# EAGLE design temphumid-gpour-usb (EAGLE 9.1.3)
CREVISION: v1.0; DESIGNER: John Cronin
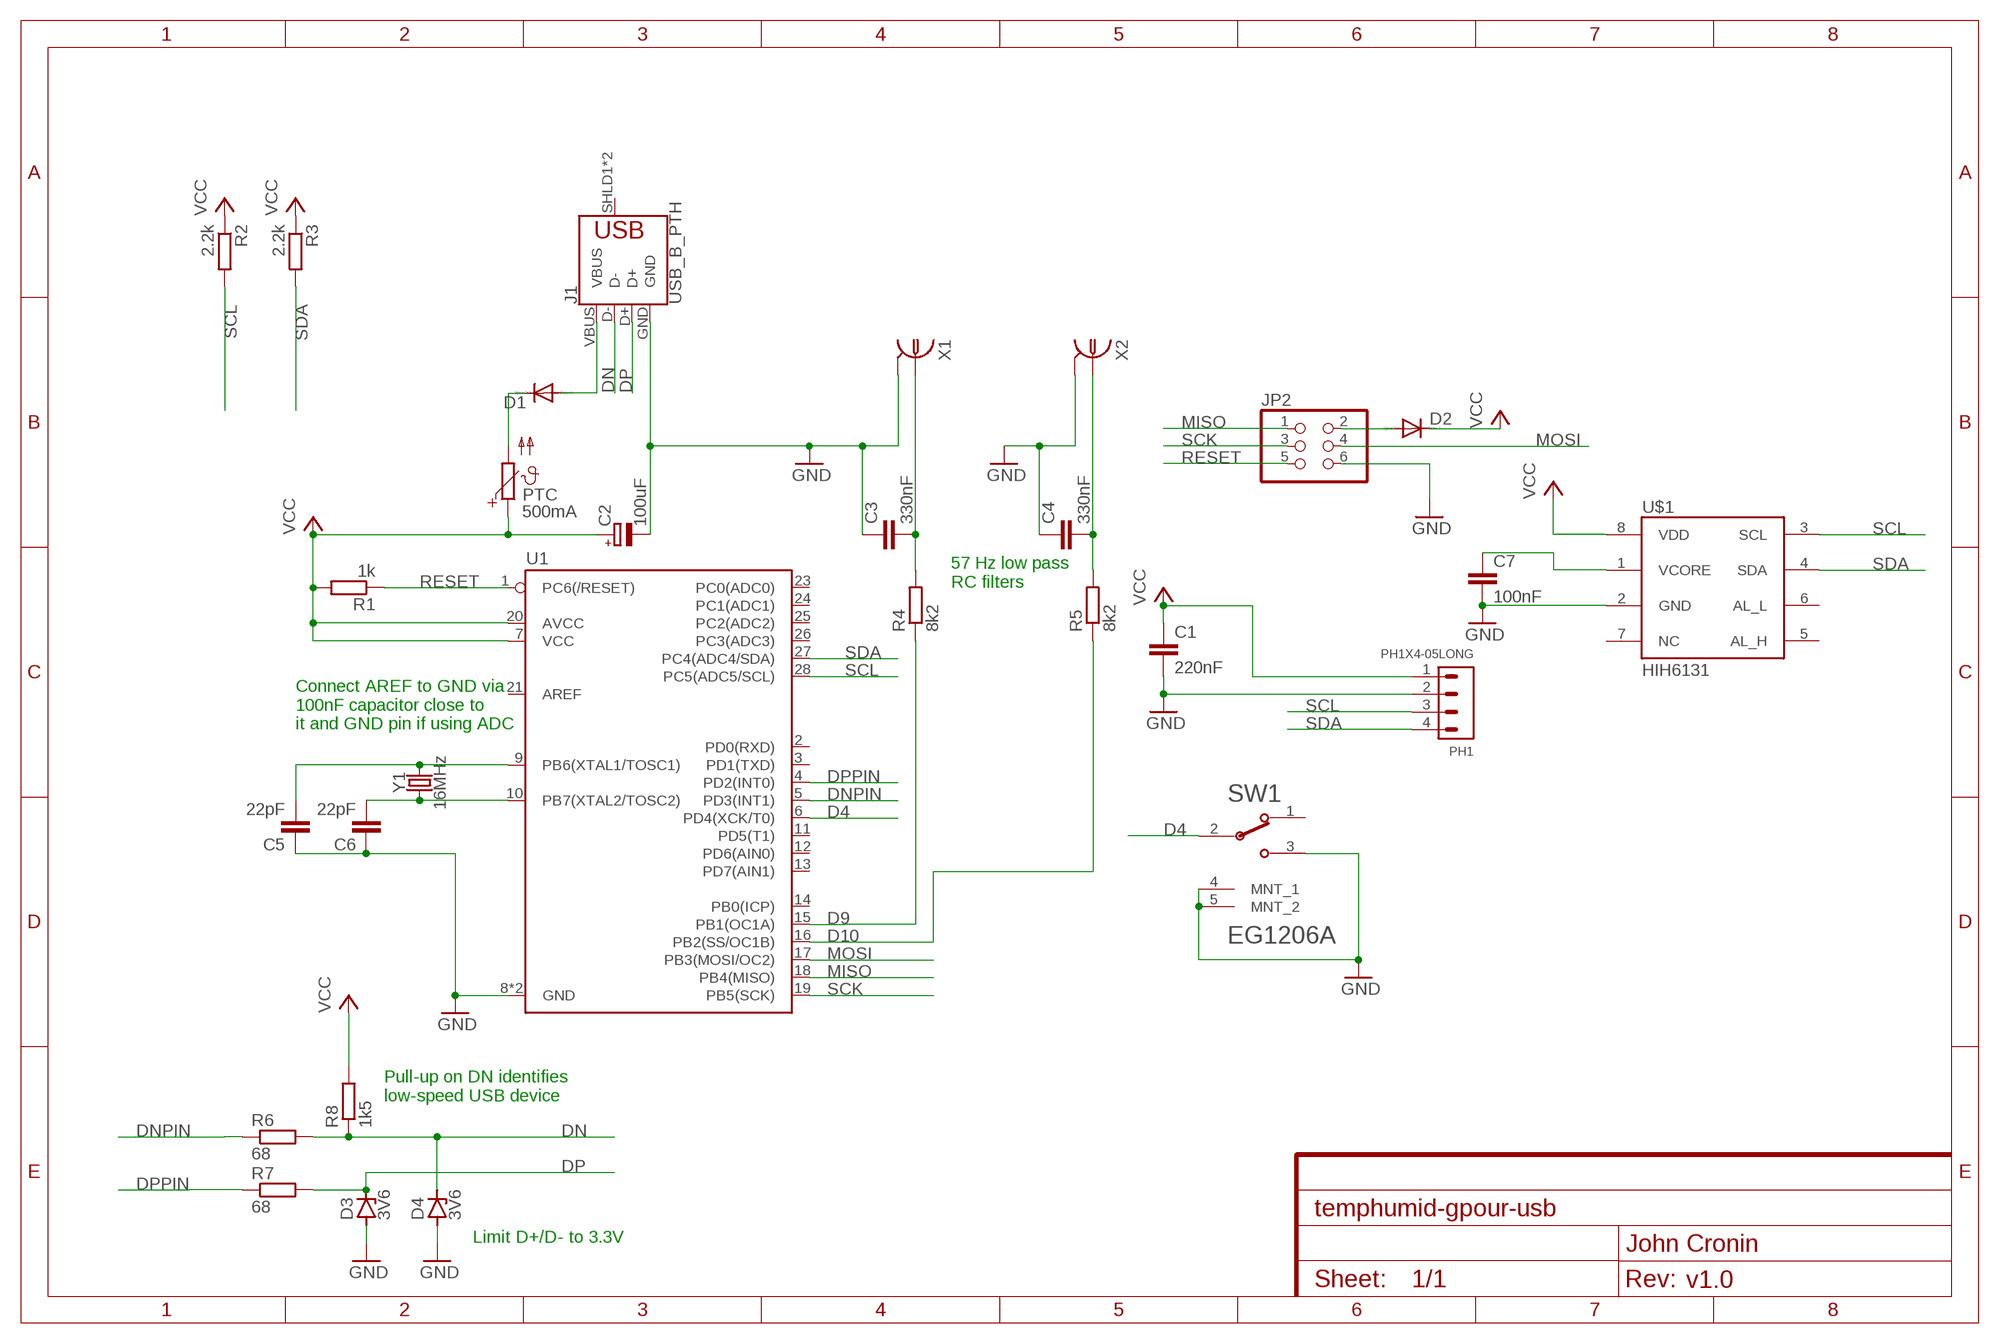
[diagram p0: schematic, sheet 1]

## Parts
C1  220nF  C-EU025-024X044  [C025-024X044]
C2  100uF  CPOL-EUE2,5-6E  [E2,5-6E]
C3  330nF  C-EU025-024X044  [C025-024X044]
C4  330nF  C-EU025-024X044  [C025-024X044]
C5  22pF  C-EU025-024X044  [C025-024X044]
C6  22pF  C-EU025-024X044  [C025-024X044]
C7  100nF  C-EU025-024X044  [C025-024X044]
D1  1N4004  [DO41-10]
D2  1N4004  [DO41-10]
D3  3V6  ZENER-DIODEDO35Z10  [DO35Z10]
D4  3V6  ZENER-DIODEDO35Z10  [DO35Z10]
J1  USB_B_PTH  [USB-B-PTH]
JP2  PINHD-2X3  [2X03]
PH1  PH1X4-05LONG  [PHL005-1-4]
PTC  500mA  PTC679  [P679]
R1  1k  R-EU_0207/7  [0207/7]
R2  2.2k  R-EU_0207/7  [0207/7]
R3  2.2k  R-EU_0207/7  [0207/7]
R4  8k2  R-EU_0207/12  [0207/12]
R5  8k2  R-EU_0207/12  [0207/12]
R6  68  R-EU_0204/7  [0204/7]
R7  68  R-EU_0204/7  [0204/7]
R8  1k5  R-EU_0204/7  [0204/7]
SW1  E-SWITCH_EG1206AE-SWITCH_EG1206A_0_0  [E-SWITCH_EG1206A_0]
U1  ATMEGA328P_PDIP  [DIP28]
U$1  HIH6131  [SOIC8]
X1  227161-8  [AMP_227161]
X2  227161-8  [AMP_227161]
Y1  16MHz  CRYSTALPTH-HC49US  [HC49US]

## Nets
D4: SW1.2(COM) U1.6(PD4(XCK/T0))
D9: R4.1 U1.15(PB1(OC1A))
D9OUT: C3.2 R4.2 X1.1
D10: R5.1 U1.16(PB2(SS/OC1B))
D10OUT: C4.2 R5.2 X2.1
DN: D4.C J1.D- R6.2 R8.1
DNPIN: R6.1 U1.5(PD3(INT1))
DP: D3.C J1.D+ R7.2
DPPIN: R7.1 U1.4(PD2(INT0))
GND: C1.2 C2.- C3.1 C4.1 C5.1 C6.1 C7.2 D3.A D4.A J1.GND JP2.6 PH1.2 SW1.3 SW1.4(MNT_1) SW1.5(MNT_2) U1.8(GND) U1.22(GND) U$1.2(GND) X1.2 X2.2
MISO: JP2.1 U1.18(PB4(MISO))
MOSI: JP2.4 U1.17(PB3(MOSI/OC2))
N$1: D1.C PTC.2
N$2: D1.A J1.VBUS
N$3: D2.A JP2.2
N$5: C5.2 U1.9(PB6(XTAL1/TOSC1)) Y1.2
N$6: C6.2 U1.10(PB7(XTAL2/TOSC2)) Y1.1
N$9: C7.1 U$1.1(VCORE)
RESET: JP2.5 R1.1 U1.1(PC6(/RESET))
SCK: JP2.3 U1.19(PB5(SCK))
SCL: PH1.3 R2.2 U1.28(PC5(ADC5/SCL)) U$1.3(SCL)
SDA: PH1.4 R3.2 U1.27(PC4(ADC4/SDA)) U$1.4(SDA)
VCC: C1.1 C2.+ D2.C PH1.1 PTC.1 R1.2 R2.1 R3.1 R8.2 U1.7(VCC) U1.20(AVCC) U$1.8(VDD)
Unconnected: J1.SHLD1(SHIELD) J1.SHLD2(SHIELD) SW1.1 U1.2(PD0(RXD)) U1.3(PD1(TXD)) U1.11(PD5(T1)) U1.12(PD6(AIN0)) U1.13(PD7(AIN1)) U1.14(PB0(ICP)) U1.21(AREF) U1.23(PC0(ADC0)) U1.24(PC1(ADC1)) U1.25(PC2(ADC2)) U1.26(PC3(ADC3)) U$1.5(AL_H) U$1.6(AL_L) U$1.7(NC)

## Notes on the sheet
- 57 Hz low pass
  RC filters
- Connect AREF to GND via
  100nF capacitor close to
  it and GND pin if using ADC
- Pull-up on DN identifies
  low-speed USB device
- Limit D+/D- to 3.3V

## Library data of the parts
C1 C3-C7 = resistor:C-EU: CAPACITOR, European symbol
C2 = resistor:CPOL-EU: POLARIZED CAPACITOR, European symbol
D1 D2 = diode:1N4004: DIODE general purpose rectifier, 1 A
D3 D4 = diode:ZENER-DIODE: Z-Diode
J1 = SparkFun-Connectors:USB_B: USB Type B Connector SparkFun Products: SparkFun Stepoko <https://www.sparkfun.com/products/13899> PTH; PROD_ID: CONN-08278; SF_ID: PRT-00139
JP2 = pinhead:PINHD-2X3: PIN HEADER
PH1 = pel_hdr:PH1X4
PTC = ptc-ntc:PTC679: PHILIPS PTC; OC_FARNELL: unknown; OC_NEWARK: unknown
R1-R8 = resistor:R-EU_: RESISTOR, European symbol
SW1 = E-Switch - EG1206A:E-SWITCH_EG1206A: Slide Switch SPDT 200mA 30V; CENTROID_NOT_SPECIFIED: No; DATASHEET: http://spec_sheets.e-switch.com/specs/P040021.pdf; DIGIKEY_DESCRIPTION: SWITCH Slide Switch SPDT Through Hole, Right Angle; DIGIKEY_PART_NUMBER: EG1917-ND; LEAD_FREE: yes; MF: E-Switch; MOUSER_PART_NUMBER: 612-EG1206A; MPN: EG1206A; PACKAGE: SIP; PREFIX: SW; ROHS: yes; TEMPERATURE_RANGE_HIGH: +70°C; TEMPERATURE_RANGE_LOW: -20°C
U1 = SparkFun-IC-Microcontroller:ATMEGA328P_PDIP: Atmel 328P Through hole ATMEGA328P uC used in the Arduino 32kb flash, 1k EEPROM, 2k SRAM Datasheet <http://www.sparkfun.com/datasheets/Components/SMD/ATMega328.pdf> SparkFun Products Storefront component: AVR 28 Pin 20MHz 32K 6A/D - ATMega328P <https://www.sparkfun.com/products/9061> (COM-09061) SparkFun Simon Says - Through-Hole Soldering Kit <https://www.sparkfun.com/products/10547> (KIT-10547) SparkFun Learn to Solder - Simon Says <https://www.sparkfun.com/products/13708> (KIT-13708) SparkFun BigTime Watch Kit <https://www.sparkfun.com/products/11734> (KIT-11734) SparkFun ClockIt <https://www.sparkfun.com/products/10930> (KIT-10930) SparkFun Serial Enabled LCD Kit <https://www.sparkfun.com/products/10097> (LCD-10097) SparkFun Simon Tilts - Through Hole Soldering Kit <https://www.sparkfun.com/products/12634> (KIT-12634) SparkFun Frequency Counter Kit <https://www.sparkfun.com/products/10140> (KIT-10140) FabFM Radio Kit <https://www.sparkfun.com/products/11043> (KIT-11043) SparkFun Binary Blaster Kit <https://www.sparkfun.com/products/12037> (KIT-12037) SparkFun Metro-Gnome <https://www.sparkfun.com/products/9236> (KIT-09236) ATmega328 with Arduino Optiboot (Uno) <https://www.sparkfun.com/products/10524> (DEV-10524); PROD_ID: IC-09136; VALUE: 328P
U$1 = SparkFun-Retired:HIH6131: Humidity sensor Not in catalog
X1 X2 = con-coax:?227161*: JACK, RIGHT ANGLE, 50 OHM, PCB, BNC Source: amp_227161.pdf; OC_FARNELL: unknown; OC_NEWARK: unknown
Y1 = SparkFun-Clocks:CRYSTAL: Crystals (Generic) These are passive quartz crystals, which can be used as a clock source for a microcontroller. Crystal's are two-terminal devices. They require external "load" capacitors to generate an oscillating signal.

## Board
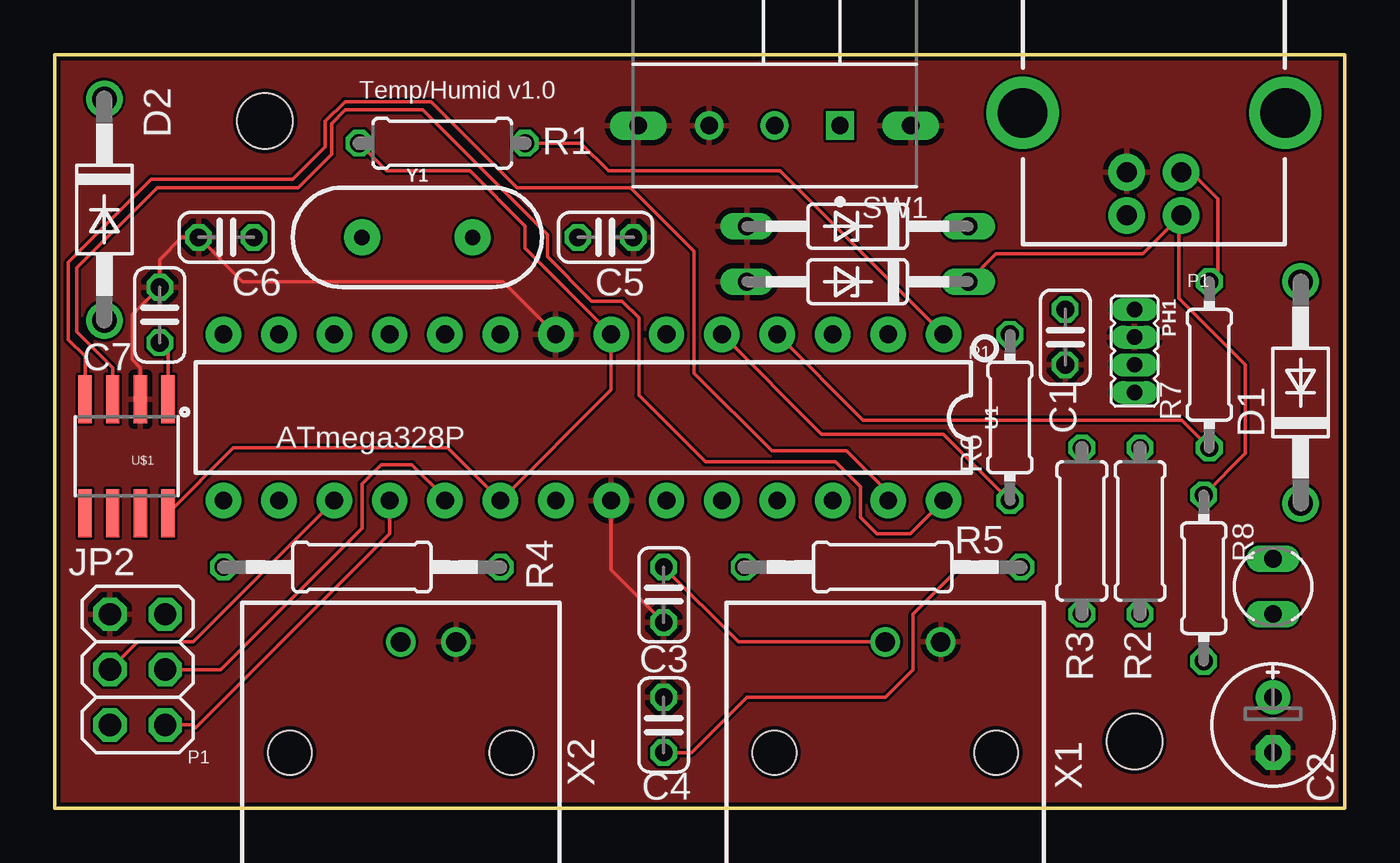
[diagram p1: board, top side]
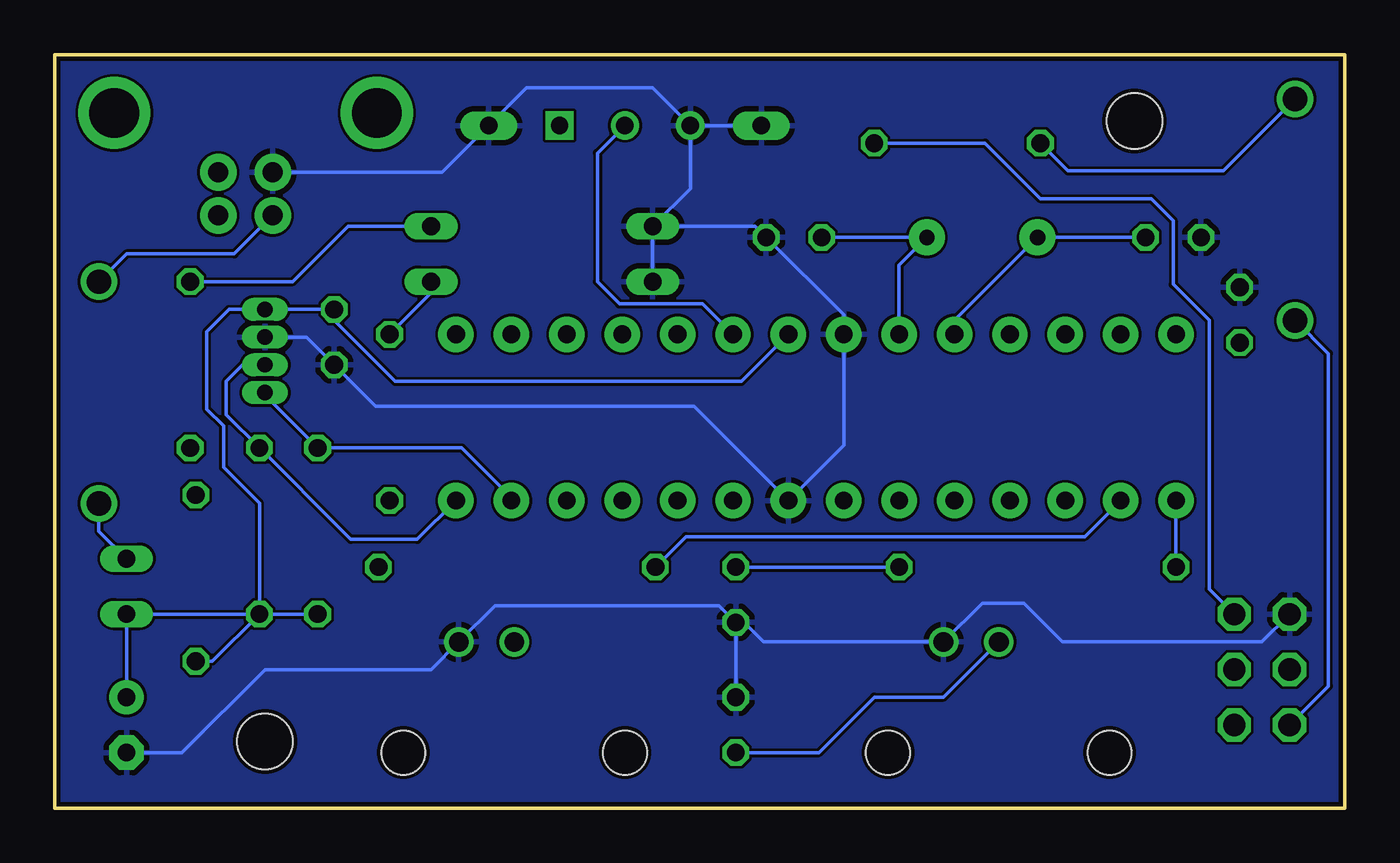
[diagram p2: board, bottom side, seen from below]

Size 59.18 x 34.54 mm. Coordinates in mm from the lower left corner, seen from the top.
Outline: 0,0 59.18,0 59.18,34.54 0,34.54 0,0
Copper layers (1*16): Top 0.035mm / dielectric 1.5mm / Bottom 0.035mm
Design rules "default *": minimum track width 6mil, minimum drill 0.2mm, track to track 5mil, track to pad 5mil, pad to pad 5mil, via to via 5mil, smd to smd 5mil, copper to edge 0.2mm, drill to drill 6mil, minimum pad ring 3mil, minimum via ring 8mil, stop-mask expansion 4mil, vias tented up to drill 0mil, thermal gap 10mil
Holes 2.54 mm at 49.53,3.05 9.65,31.5

### Footprints (pad centres in the part's own frame; a part is rotated, then mirrored left to right if it is on the bottom)
C025-024X044 = drill 0.813 octagon: 1 -1.27,0; 2 1.27,0
E2,5-6E = drill 0.813 pad 1.575: + -1.27,0 | drill 0.813 pad 1.575 octagon: - 1.27,0
DO41-10 = drill 1.118: A 5.08,0; C -5.08,0
DO35Z10 = drill 0.813 long: A 5.08,0; C -5.08,0
USB-B-PTH = drill 0.914 pad 1.676: D+ 4,1.25; D- 5.981,1.25; GND 4,-1.25; VBUS 5.981,-1.25 | drill 2.286: SHLD1 1.282,-6.02; SHLD2 1.282,6.02
2X03 = drill 1.016 octagon: 1 -2.54,-1.27; 2 -2.54,1.27; 3 0,-1.27; 4 0,1.27; 5 2.54,-1.27; 6 2.54,1.27
PHL005-1-4 = drill 0.7 pad 1.016 long: 1 0,0; 2 1.27,0; 3 2.54,0; 4 3.81,0
P679 = drill 0.813 long: 1 -1.27,0; 2 1.27,0
0207/7 = drill 0.813 octagon: 1 -3.81,0; 2 3.81,0
0207/12 = drill 0.813 octagon: 1 -6.35,0; 2 6.35,0
0204/7 = drill 0.813 octagon: 1 -3.81,0; 2 3.81,0
E-SWITCH_EG1206A_0 = drill 0.8 pad 1.3 square: 1 -3,3 | drill 0.8 pad 1.3: 2 0,3; 3 3,3 | drill 0.8 pad 1.3 long: 4 -6.25,3; 5 6.25,3
DIP28 = drill 0.813 pad 1.626: 1 -16.51,-3.81; 2 -13.97,-3.81; 3 -11.43,-3.81; 4 -8.89,-3.81; 5 -6.35,-3.81; 6 -3.81,-3.81; 7 -1.27,-3.81; 8 1.27,-3.81; 9 3.81,-3.81; 10 6.35,-3.81; 11 8.89,-3.81; 12 11.43,-3.81; 13 13.97,-3.81; 14 16.51,-3.81; 15 16.51,3.81; 16 13.97,3.81; 17 11.43,3.81; 18 8.89,3.81; 19 6.35,3.81; 20 3.81,3.81; 21 1.27,3.81; 22 -1.27,3.81; 23 -3.81,3.81; 24 -6.35,3.81; 25 -8.89,3.81; 26 -11.43,3.81; 27 -13.97,3.81; 28 -16.51,3.81
SOIC8 = smd 0.61 x 2.21: 1 -1.905,-2.616; 2 -0.635,-2.616; 3 0.635,-2.616; 4 1.905,-2.616; 5 1.905,2.616; 6 0.635,2.616; 7 -0.635,2.616; 8 -1.905,2.616
AMP_227161 = drill 0.9 pad 1.27: 1 0,-5.08; 2 -2.54,-5.08 | hole 2: -5.08,0; 5.08,0
HC49US = drill 0.7 pad 1.651: 1 -2.54,0; 2 2.54,0

### Placement (x,y rotation side)
C1  46.36,21.59 270 top
C2  55.88,3.81 270 top
C3  27.94,9.78 90 top
C4  27.94,3.81 270 top
C5  25.27,26.16 180 top
C6  7.87,26.16 0 top
C7  4.83,22.61 90 top
D1  57.15,19.05 90 top
D2  2.29,27.43 270 top
D3  36.83,26.67 180 top
D4  36.83,24.13 180 top
J1  50.42,33.15 270 top
JP2  3.81,6.35 90 top
PH1  49.53,22.86 270 top
PTC  55.88,10.16 90 top
R1  17.78,30.48 180 top
R2  49.78,12.7 90 top
R3  47.12,12.7 90 top
R4  14.1,11.05 0 top
R5  37.97,11.05 0 top
R6  43.82,17.91 90 top
R7  52.96,20.32 90 top
R8  52.71,10.54 270 top
SW1  33.02,34.29 180 top
U1  24.26,17.91 180 top
U$1  3.3,16.13 180 top
X1  38.1,2.54 180 top
X2  15.88,2.54 180 top
Y1  16.64,26.16 0 top

### Tracks (layer width: path | path; a pad name or v marks a point on that pad's centre or on a via)
D4
  Bottom 0.152: SW1.2 34.29,30.02 34.29,24.13 33.27,23.11 29.46,23.11 U1.6
D9
  Bottom 0.152: R4.1 U1.15
D9OUT
  Top 0.152: C3.2 31.37,7.62 X1.1
  Bottom 0.152: C3.2 R4.2
D10
  Bottom 0.152: R5.1 30.23,12.45 11.94,12.45 U1.16
D10OUT
  Top 0.152: C4.2 29.21,2.54 31.75,5.08 38.1,5.08 39.37,6.35 39.37,8.89 41.53,11.05 R5.2
  Bottom 0.152: C4.2 24.13,2.54 21.59,5.08 18.41,5.08 X2.1
DN
  Top 0.152: D4.C 43.18,25.4 49.9,25.4 51.56,27.05 | 51.56,27.05 J1.D- | R8.1 54.61,16.26 54.61,20.32 51.56,23.37 51.56,27.05
  Bottom 0.152: R6.2 41.91,23.62 D4.C
DNPIN
  Top 0.152: R6.1 40.77,17.14 35.18,17.14 U1.5
DP
  Top 0.152: R7.2 53.34,24.51 53.34,27.94 52.13,29.15 J1.D+
  Bottom 0.152: R7.2 48.26,24.13 45.72,26.67 D3.C
DPPIN
  Top 0.152: R7.1 51.69,17.78 37.08,17.78 U1.4
GND
  Top 0.152: U1.8 20.57,24.13 8.64,24.13 C6.1 5.84,26.16 4.83,25.15 C7.2 3.56,22.61 3.56,20.57 3.94,20.19 U$1.2 | U1.22 25.53,10.92 C3.1
  Bottom 0.152: J1.GND 41.41,29.15 SW1.4 37.54,33.02 31.75,33.02 SW1.3 | SW1.3 SW1.5 | SW1.3 30.02,28.4 D3.A | D3.A D4.A | D3.A 27.05,26.67 C5.1 22.99,22.61 U1.8 22.99,16.64 U1.22 29.85,18.41 44.45,18.41 C1.2 47.62,21.59 PH1.2 | C2.- 53.34,2.54 49.53,6.35 41.91,6.35 X1.2 38.99,9.27 28.7,9.27 C3.1 | C3.1 C4.1 | C3.1 27.56,8.51 26.67,7.62 X2.2 16.64,9.4 14.73,9.4 12.95,7.62 3.81,7.62 JP2.6
  pour Bottom: -2.54,35.56 -2.54,-2.54 -1.27,-3.81 59.69,-3.81 62.23,-1.27 62.23,33.02 59.69,35.56
  pour Top: -2.54,35.56 -2.54,-3.81 62.23,-3.81 62.23,35.56
MISO
  Top 0.152: JP2.1 6.35,3.81 6.48,3.68 15.37,12.57 U1.18
MOSI
  Top 0.152: JP2.4 3.81,7.62 6.35,7.62 U1.17
N$1
  Bottom 0.152: D1.C 57.15,12.7 PTC.2
N$2
  Bottom 0.152: J1.VBUS 50.94,25.4 55.88,25.4 D1.A
N$3
  Bottom 0.152: JP2.2 0.76,5.59 0.76,20.83 D2.A
N$5
  Bottom 0.152: C5.2 Y1.2 20.45,24.89 U1.9
N$6
  Bottom 0.152: U1.10 17.91,22.35 Y1.1 C6.2
N$9
  Top 0.152: U$1.1 5.21,20.95 C7.1
RESET
  Top 0.152: R1.1 24.13,30.48 25.4,29.21 33.27,29.21 U1.1
  Bottom 0.152: R1.1 16.51,30.48 13.97,27.94 8.89,27.94 7.87,26.92 7.87,24 6.22,22.35 6.22,10.03 JP2.5
SCK
  Top 0.152: JP2.3 7.62,6.35 14.1,12.83 14.1,14.86 14.99,15.75 16.38,15.75 17.91,14.22 U1.19
SCL
  Top 0.152: U$1.3 2.67,20.19 1.02,21.84 1.02,24.77 4.7,28.45 11.18,28.45 12.7,29.97 12.7,31.37 13.33,32 16.89,32 22.61,26.29 22.61,25.27 24.64,23.24 26.04,23.24 26.8,22.48 26.8,18.92 29.85,15.88 35.81,15.88 36.96,14.73 36.96,13.34 37.72,12.57 39.24,12.57 U1.28
  Bottom 0.152: PH1.3 50.55,20.32 51.31,19.56 51.31,18.03 R2.2 45.85,12.57 45.59,12.32 42.55,12.32 U1.28
SDA
  Top 0.152: 1.4,18.92 U$1.4 1.4,20.7 0.64,21.46 0.64,25.02 4.44,28.83 10.92,28.83 12.42,30.33 12.42,31.48 13.32,32.38 17.27,32.38 21.21,28.45 26.42,28.45 29.34,25.53 29.34,19.94 32.89,16.38 36.32,16.38 38.23,14.48 U1.27
  Bottom 0.152: PH1.4 49.53,18.92 R3.2 40.51,16.51 38.23,14.22 U1.27
VCC
  Top 0.152: R1.2 15.24,29.21 19.05,29.21 21.59,26.67 21.59,25.65 U1.7 25.53,19.18 U1.20 18.03,16.51 8.2,16.51 U$1.8
  Bottom 0.152: C2.+ PTC.1 R2.1 | R2.1 R3.1 | R2.1 51.94,6.73 R8.2 | R2.1 49.78,13.97 51.44,15.62 51.44,17.53 52.2,18.29 52.2,21.84 51.18,22.86 PH1.1 C1.1 46.36,22.35 43.56,19.56 27.69,19.56 U1.7 | R1.2 12.7,29.21 5.59,29.21 D2.C

### Text on the board
tPlace: Temp/Humid v1.0 | P1 | P1 | ATmega328P | P1